# EAGLE schematic ft232 (EAGLE 7.4.0)
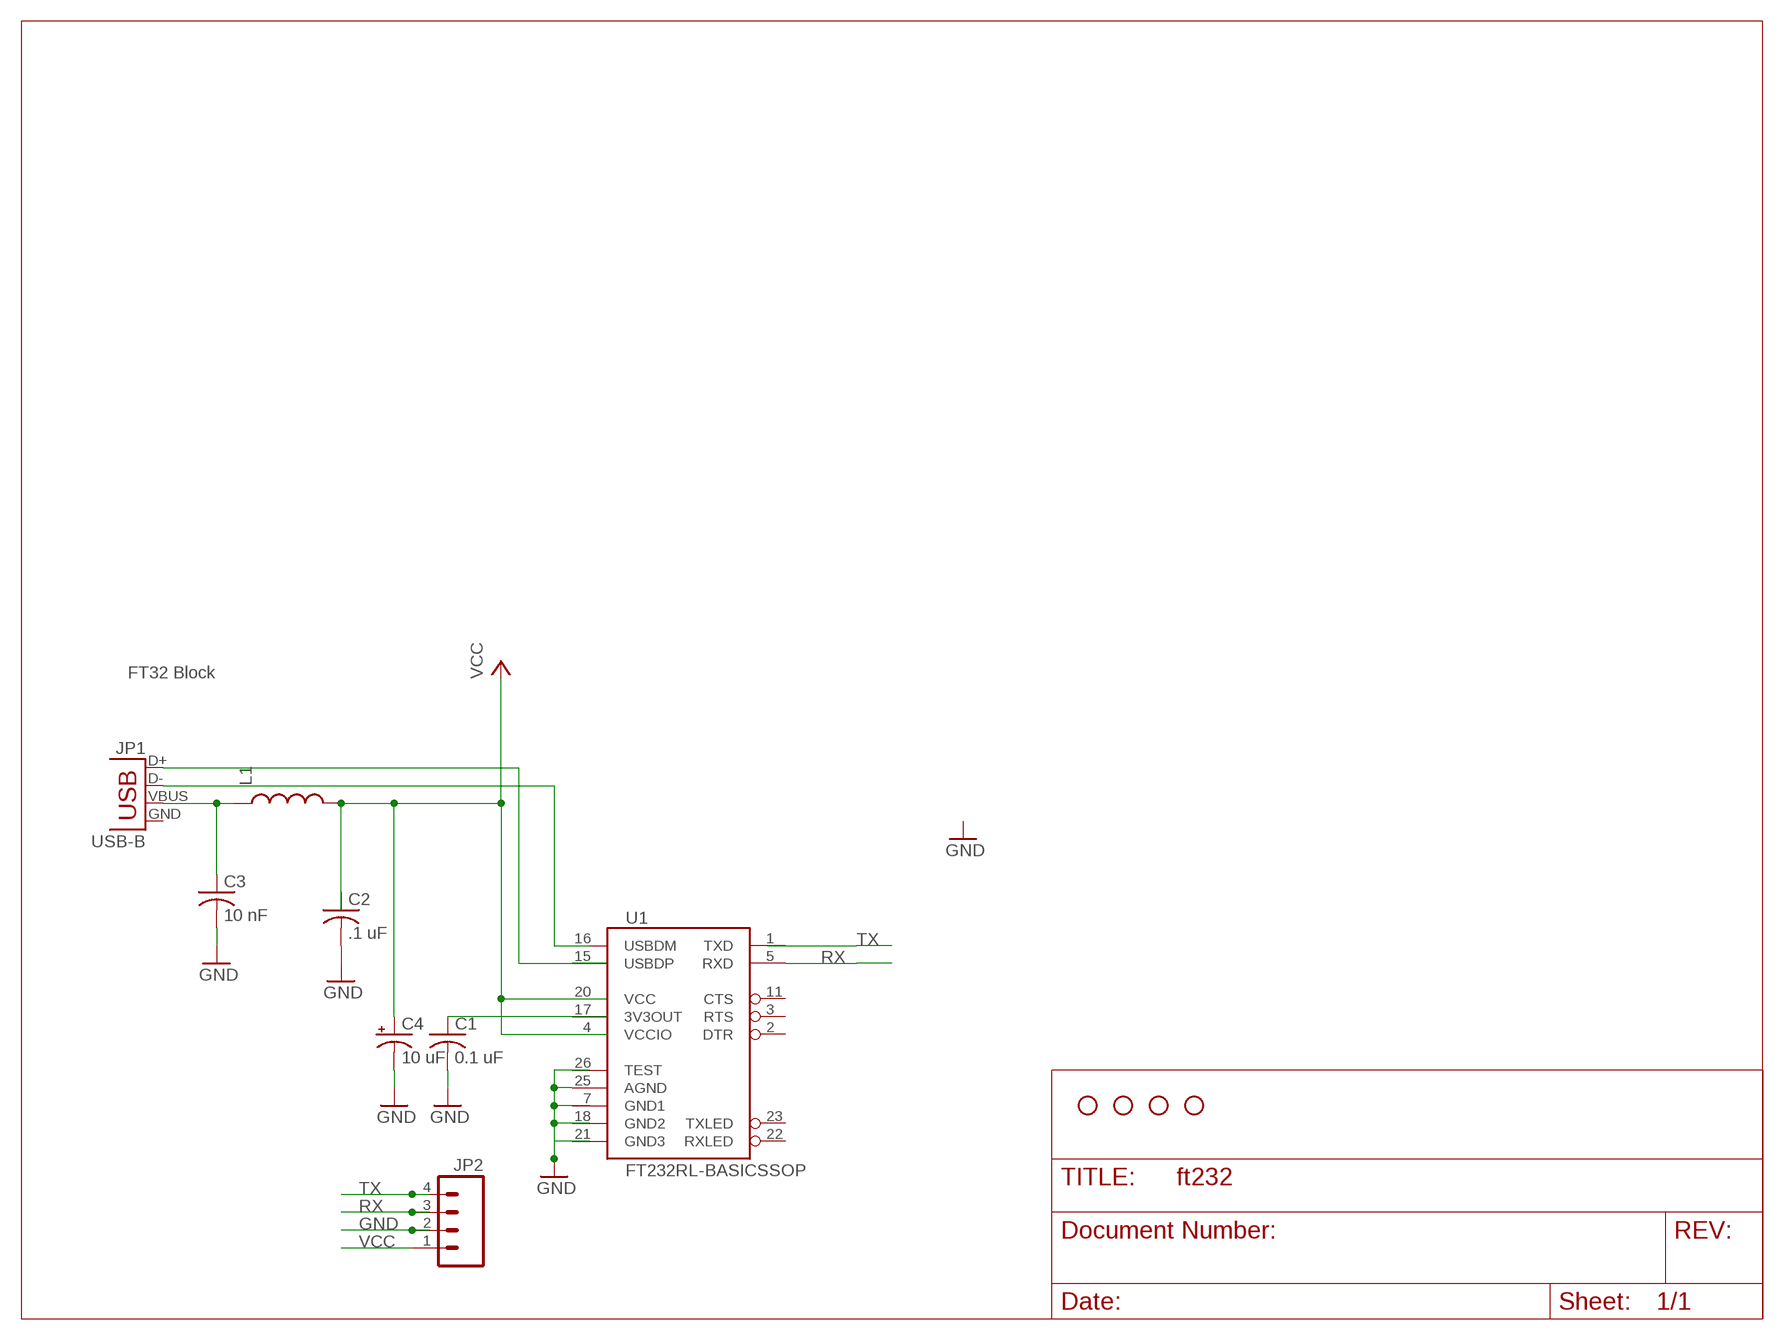
[diagram p0: schematic, sheet 1]

## Parts
C1  0.1 uF  C-USC0603  [C0603]
C2  .1 uF  C-USC0603  [C0603]
C3  10 nF  C-USC0603  [C0603]
C4  10 uF  CAP_POL1206  [EIA3216]
JP1  USB-B  USBPTH  [USB-B-PTH]
JP2  M04PTH  [1X04]
L1  INDUCTOR0603  [0603]
STANDOFF1  STAND-OFF  [STAND-OFF]
STANDOFF2  STAND-OFF  [STAND-OFF]
STANDOFF3  STAND-OFF  [STAND-OFF]
STANDOFF4  STAND-OFF  [STAND-OFF]
U1  FT232RL-BASICSSOP  [SSOP28DB]

## Nets
GND: C1.2 C2.2 C3.2 C4.C(-) JP2.2 U1.25(AGND)
N$1: C3.1 JP1.VBUS L1.1
N$3: C1.1
N$5: JP1.D+
N$6: JP1.D-
RX: JP2.3 U1.5(RXD)
TX: JP2.4
VCC: C4.A(+) JP2.1 L1.2
Unconnected: C2.1 JP1.GND U1.1(TXD) U1.2(DTR) U1.3(RTS) U1.11(CTS) U1.15(USBDP) U1.16(USBDM) U1.17(3V3OUT) U1.22(RXLED) U1.23(TXLED) U1.26(TEST)

## Notes on the sheet
- FT32 Block

## Power pins joined to a net without a drawn wire
GND1: U1.7(GND1)
GND2: U1.18(GND2)
GND3: U1.21(GND3)
VCC: U1.20(VCC)
VCCIO: U1.4(VCCIO)

## Library data of the parts
C1-C3 = resistor:C-US: CAPACITOR, American symbol
C4 = SparkFun-Passives:CAP_POL: Capacitor Polarized These are standard SMD and PTH capacitors. Normally 10uF, 47uF, and 100uF in electrolytic and tantalum varieties. Always verify the external diameter of the through hole cap, it varies with capacity, voltage, and manufacturer. The EIA devices should be standard.
JP1 = SparkFun-Connectors:USB: USB Connectors USB-B-PTH is fully proven SKU : PRT-00139/CONN-08278 USB-miniB is fully proven SKU : PRT-00587 USB-A-PCB is untested. USB-A-H is throughly reviewed, but untested. Spark Fun Electronics SKU : PRT-00437 USB-B-SMT is throughly reviewed, but untested. Needs silkscreen touching up. USB-A-S has not been used/tested USB-MB-H has not been used/tested USB-MICROB has been used. CONN-09505; PROD_ID: CONN-08278
JP2 = SparkFun-Connectors:M04: Header 4 Standard 4-pin 0.1" header. Use with straight break away headers (SKU : PRT-00116), right angle break away headers (PRT-00553), swiss pins (PRT-00743), machine pins (PRT-00117), and female headers (PRT-00115). Molex polarized connector foot print use with SKU : PRT-08231 with associated crimp pins and housings. 1MM SMD Version SKU: PRT-10208
L1 = SparkFun-Passives:INDUCTOR: Inductors Basic Inductor/Choke - 0603 and 1206. Footprints are not proven and vary greatly between part numbers. INDUCTOR POWER 3.3UH 4.0A SMD 0.197" L x 0.197" W x 0.177" H (5.00mm x 5.00mm x 4.50mm)
STANDOFF1-STANDOFF4 = SparkFun-Electromechanical:STAND-OFF: #4 Stand Off This is the mechanical footprint for a #4 phillips button head screw. Use the keepout ring to avoid running the screw head into surrounding components. SKU : PRT-00447
U1 = SparkFun-DigitalIC:FT232RL-BASIC: USB UART This is the simplified version of the FT232RL unit. Only what you need, nothing you don't. Spark Fun Electronics SKU : COM-00650